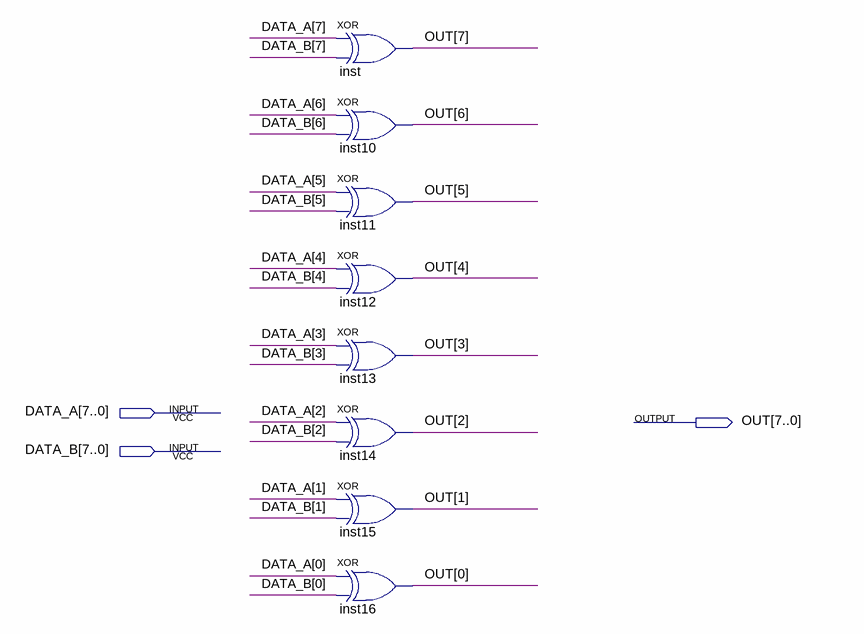
[diagram p0: schematic sheet]
// Quartus schematic XOR8bit.bdf as structural Verilog: 8 symbols, 3 pins
module XOR8bit (
  input  [7:0] DATA_A,
  input  [7:0] DATA_B,
  output [7:0] OUT
);

  xor inst (OUT[7], DATA_A[7], DATA_B[7]);
  xor inst10 (OUT[6], DATA_A[6], DATA_B[6]);
  xor inst11 (OUT[5], DATA_A[5], DATA_B[5]);
  xor inst12 (OUT[4], DATA_A[4], DATA_B[4]);
  xor inst13 (OUT[3], DATA_A[3], DATA_B[3]);
  xor inst14 (OUT[2], DATA_A[2], DATA_B[2]);
  xor inst15 (OUT[1], DATA_A[1], DATA_B[1]);
  xor inst16 (OUT[0], DATA_A[0], DATA_B[0]);
endmodule
